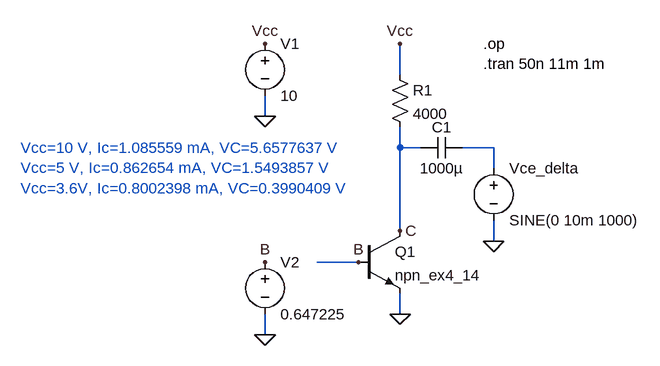
[diagram p0: schematic Draft4.asc]
Draft4.asc, the LTspice schematic file:
Version 4
SHEET 1 880 680
WIRE 384 128 384 80
WIRE 176 192 176 160
WIRE 384 240 384 208
WIRE 416 240 384 240
WIRE 528 240 480 240
WIRE 528 272 528 240
WIRE 384 368 384 240
WIRE 528 384 528 352
WIRE 320 416 256 416
WIRE 384 496 384 464
WIRE 176 528 176 496
FLAG 384 496 0
FLAG 176 192 0
FLAG 176 80 Vcc
FLAG 384 80 Vcc
FLAG 320 416 B
FLAG 528 384 0
FLAG 176 528 0
FLAG 176 416 B
FLAG 384 368 C
DATAFLAG 384 304 "$"
SYMBOL voltage 176 64 R0
SYMATTR InstName V1
SYMATTR Value 10
SYMBOL voltage 528 256 R0
SYMATTR InstName Vce_delta
SYMATTR Value SINE(0 10m 1000)
SYMBOL Cap 416 224 M90
WINDOW 0 0 32 VBottom 2
WINDOW 3 32 32 VTop 2
SYMATTR InstName C1
SYMATTR Value 1000µ
SYMBOL voltage 176 400 R0
SYMATTR InstName V2
SYMATTR Value 0.647225
SYMBOL Res 368 112 R0
SYMATTR InstName R1
SYMATTR Value 4000
SYMBOL npn 320 368 R0
SYMATTR InstName Q1
SYMATTR Value npn_ex4_14
TEXT 512 80 Left 2 !.op\n.tran 50n 11m 1m
TEXT -200 240 Left 2 ;Vcc=10 V, Ic=1.085559 mA, VC=5.6577637 V\nVcc=5 V, Ic=0.862654 mA, VC=1.5493857 V\nVcc=3.6V, Ic=0.8002398 mA, VC=0.3990409 V

The netlist it stands for:
* Draft4.asc
V1 Vcc 0 10
Vce_delta N001 0 SINE(0 10m 1000)
C1 C N001 1000µ
V2 B 0 0.647225
R1 Vcc C 4000
Q1 C B 0 0 npn_ex4_14
.model NPN NPN
.model PNP PNP
.lib standard.bjt
.op
.tran 50n 11m 1m
* Vcc=10 V, Ic=1.085559 mA, VC=5.6577637 V
* Vcc=5 V, Ic=0.862654 mA, VC=1.5493857 V
* Vcc=3.6V, Ic=0.8002398 mA, VC=0.3990409 V
.backanno
.end